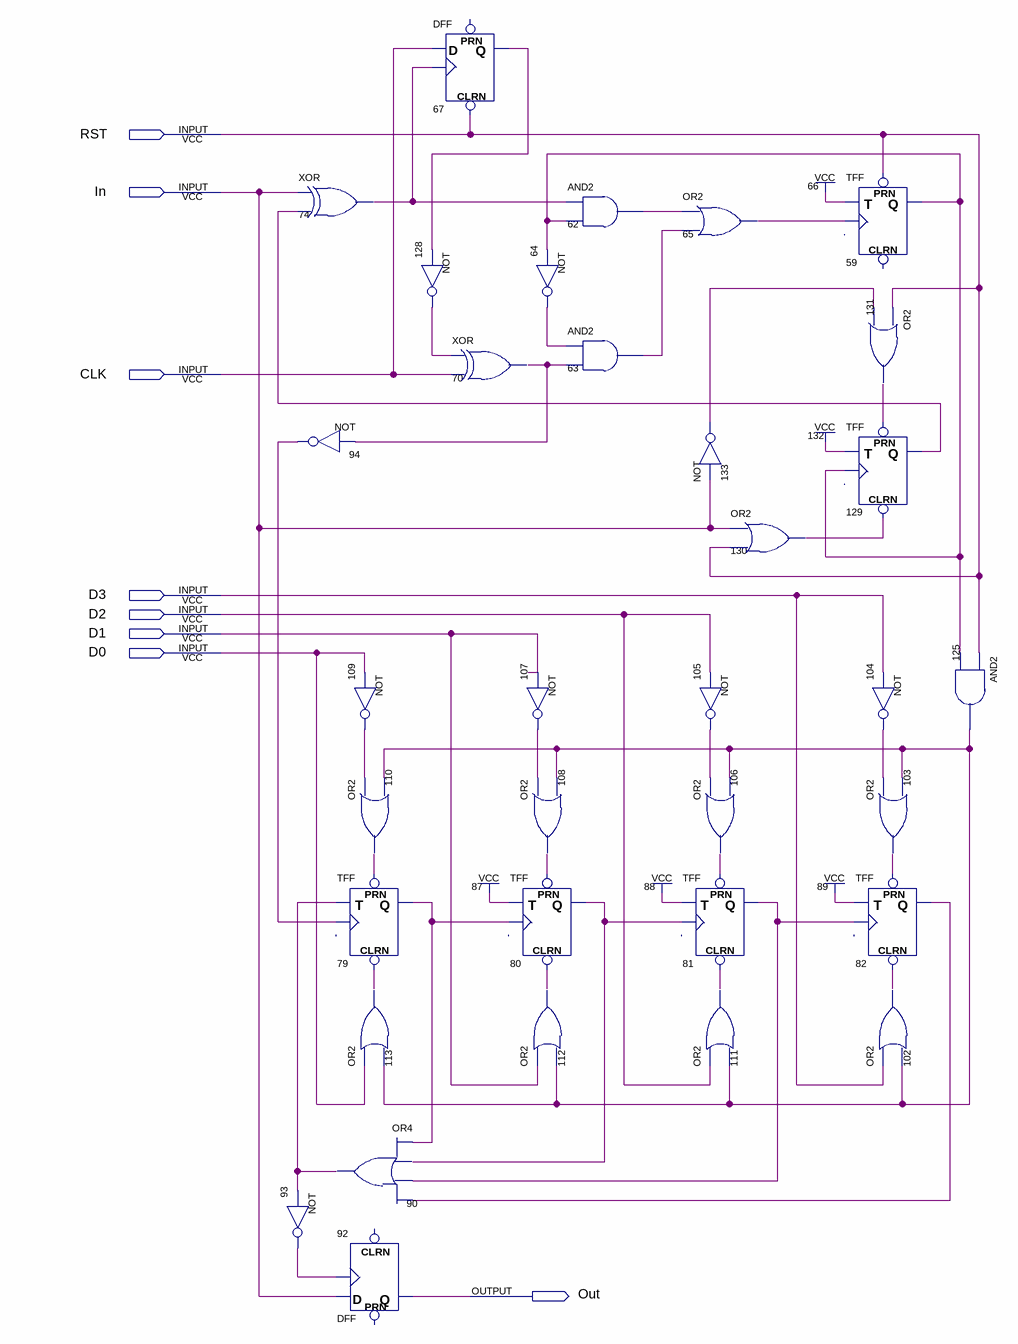
[diagram p0: schematic sheet]
// Quartus schematic unifilter4.bdf as structural Verilog: 34 symbols, 8 pins
module unifilter4 (
  input  RST,
  input  In,
  input  CLK,
  input  D3,
  input  D2,
  input  D1,
  input  D0,
  output Out
);

  wire n59_q, n62_out, n63_out, n64_out, n65_out, n67_q, n70_out, n74_out, n79_q, n80_q, n81_q, n82_q,
       n90_out, n93_out, n94_out, n102_out, n103_out, n104_out, n105_out, n106_out, n107_out, n108_out,
       n109_out, n110_out, n111_out, n112_out, n113_out, n125_out, n128_out, n129_q, n130_out, n131_out,
       n133_out;

  xor u_74 (n74_out, In, n129_q);
  not u_94 (n94_out, n70_out);
  not u_93 (n93_out, n90_out);
  not u_109 (n109_out, D0);
  or u_110 (n110_out, n109_out, n125_out);
  TFF u_79 (.PRN(n110_out), .CLRN(n113_out), .T(n90_out), .CLK(n94_out), .Q(n79_q));
  or u_113 (n113_out, D0, n125_out);
  or u_90 (n90_out, n79_q, n80_q, n81_q, n82_q);
  DFF u_92 (.CLK(n93_out), .D(In), .Q(Out));  // open: CLRN, PRN
  DFF u_67 (.CLRN(RST), .CLK(n74_out), .D(CLK), .Q(n67_q));  // open: PRN
  not u_128 (n128_out, n67_q);
  xor u_70 (n70_out, n128_out, CLK);
  not u_64 (n64_out, n59_q);
  not u_107 (n107_out, D1);
  or u_108 (n108_out, n107_out, n125_out);
  TFF u_80 (.PRN(n108_out), .CLRN(n112_out), .T(1'b1), .CLK(n79_q), .Q(n80_q));
  or u_112 (n112_out, D1, n125_out);
  and u_62 (n62_out, n74_out, n59_q);
  and u_63 (n63_out, n64_out, n70_out);
  or u_65 (n65_out, n62_out, n63_out);
  not u_133 (n133_out, In);
  not u_105 (n105_out, D2);
  or u_106 (n106_out, n105_out, n125_out);
  TFF u_81 (.PRN(n106_out), .CLRN(n111_out), .T(1'b1), .CLK(n80_q), .Q(n81_q));
  or u_111 (n111_out, D2, n125_out);
  or u_130 (n130_out, In, RST);
  TFF u_59 (.PRN(RST), .T(1'b1), .CLK(n65_out), .Q(n59_q));  // open: CLRN
  TFF u_129 (.PRN(n131_out), .CLRN(n130_out), .T(1'b1), .CLK(n59_q), .Q(n129_q));
  TFF u_82 (.PRN(n103_out), .CLRN(n102_out), .T(1'b1), .CLK(n81_q), .Q(n82_q));
  or u_131 (n131_out, RST, n133_out);
  not u_104 (n104_out, D3);
  or u_103 (n103_out, n104_out, n125_out);
  or u_102 (n102_out, D3, n125_out);
  and u_125 (n125_out, RST, n59_q);
endmodule
